# Altium schematic sheet FilterBoard.Schematic.SchDoc
size B
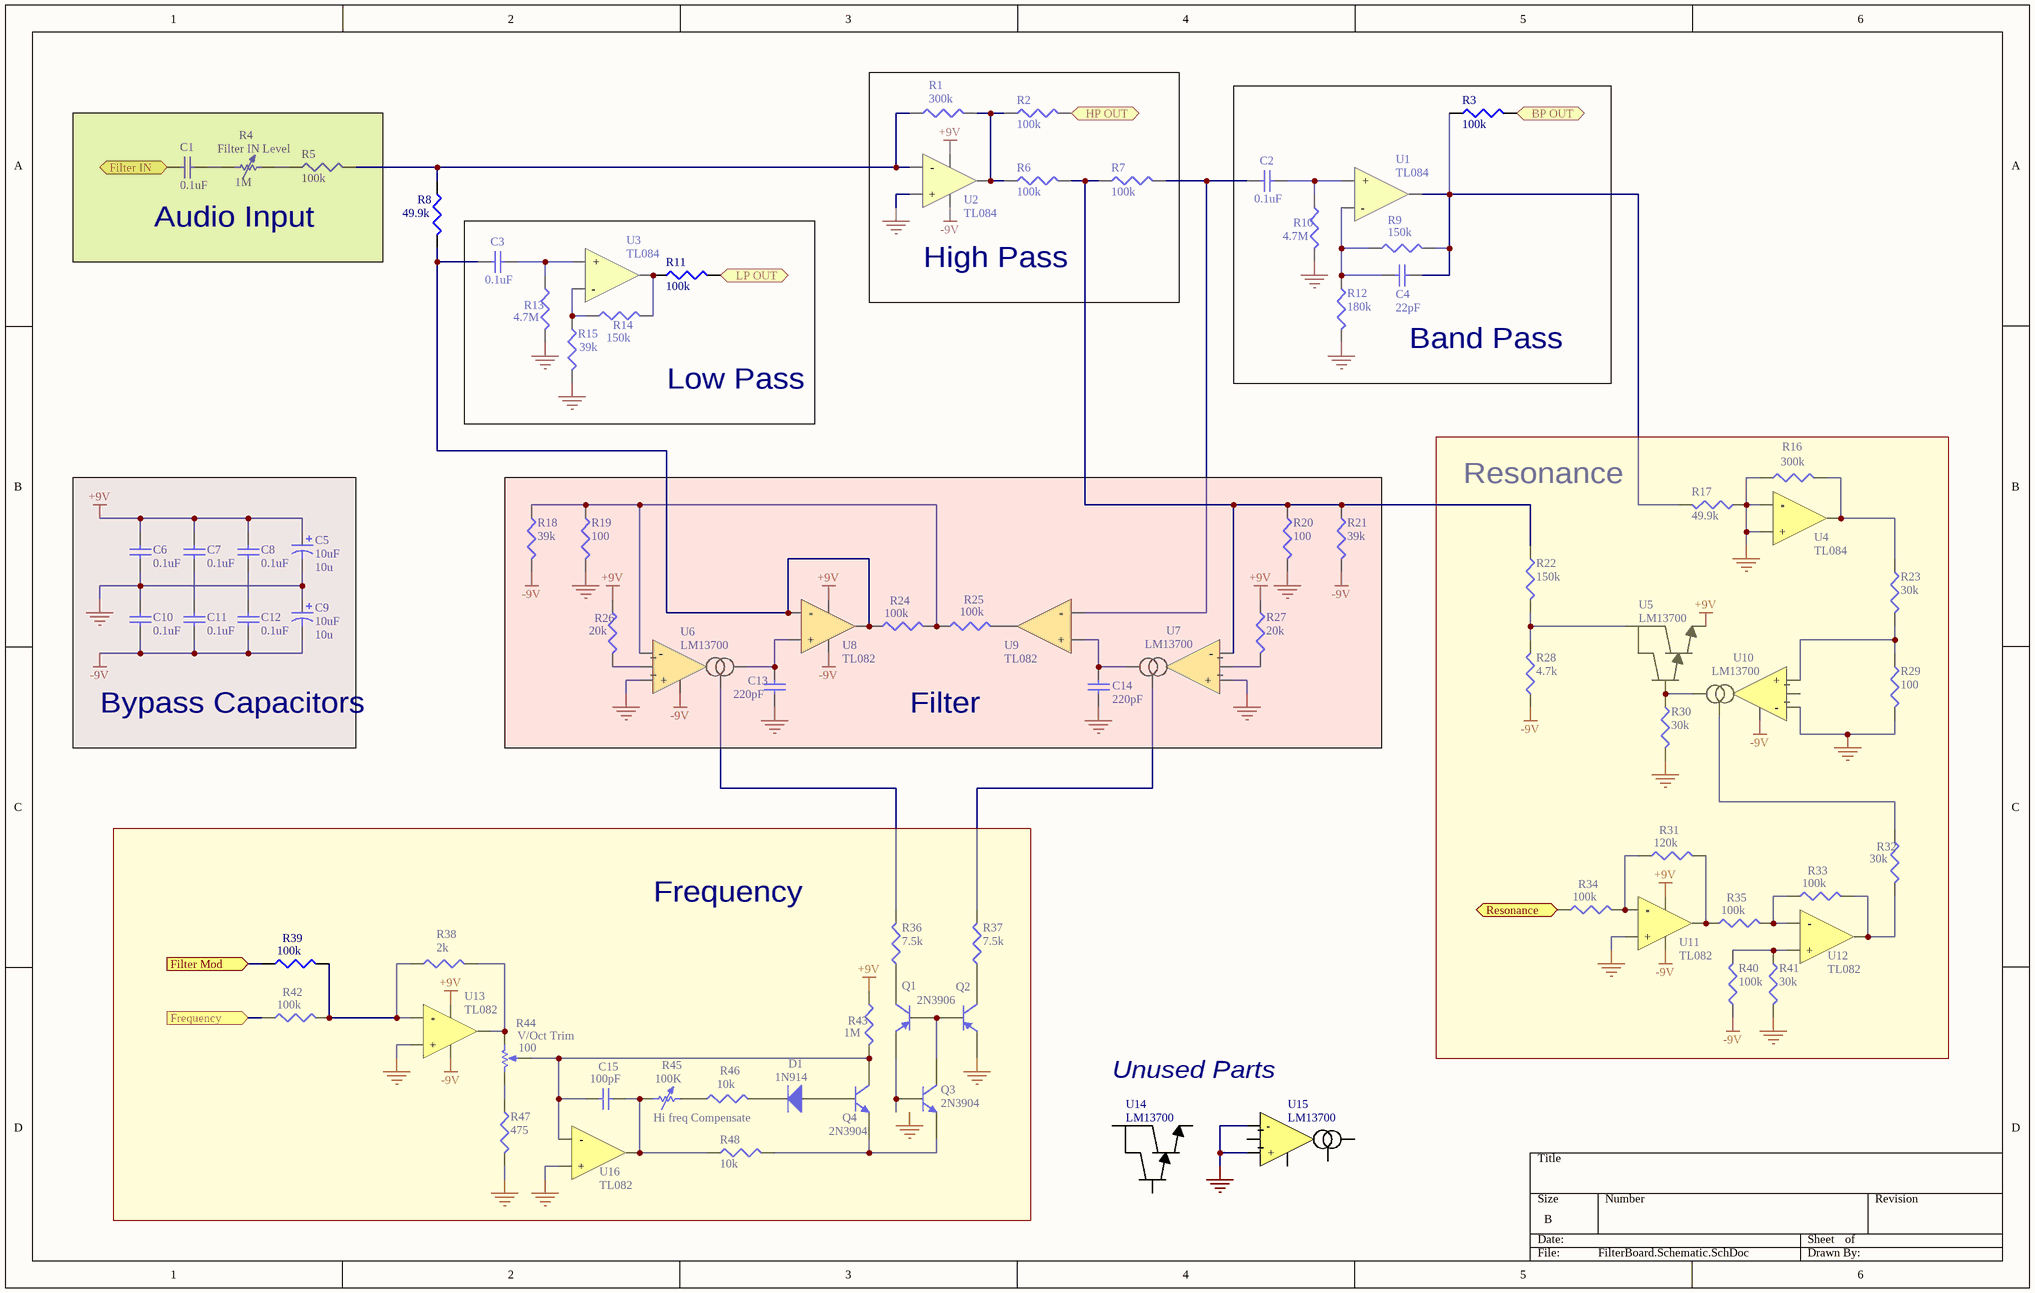
[diagram p0: FilterBoard.Schematic.SchDoc]

## Parts
C1  0.1uF  [C1206]
C2  0.1uF  [C1206]
C3  0.1uF  [C1206]
C4  22pF  [C1206]
C5  10uF  value 10u  [RB7.6-15]
C6  0.1uF  [C1206]
C7  0.1uF  [C1206]
C8  0.1uF  [C1206]
C9  10uF  value 10u  [RB7.6-15]
C10  0.1uF  [C1206]
C11  0.1uF  [C1206]
C12  0.1uF  [C1206]
C13  220pF  [C1206]
C14  220pF  [C1206]
C15  100pF  [C1206]
D1  1N914  [DO-41]
Q1  2N3906  [TO-92A]
Q2  2N3906  [TO-92A]  (value not drawn)
Q3  2N3904  [TO-92A]
Q4  2N3904  [TO-92A]
R1  300k  [J1-0603]
R2  100k  [J1-0603]
R3  100k  [J1-0603]
R4  Filter IN Level  value 1M  [AXIAL-0.7]
R5  100k  [J1-0603]
R6  100k  [J1-0603]
R7  100k  [J1-0603]
R8  49.9k  [J1-0603]
R9  150k  [J1-0603]
R10  4.7M  [J1-0603]
R11  100k  [J1-0603]
R12  180k  [J1-0603]
R13  4.7M  [J1-0603]
R14  150k  [J1-0603]
R15  39k  [J1-0603]
R16  300k  [J1-0603]
R17  49.9k  [J1-0603]
R18  39k  [J1-0603]
R19  100  [J1-0603]
R20  100  [J1-0603]
R21  39k  [J1-0603]
R22  150k  [J1-0603]
R23  30k  [J1-0603]
R24  100k  [J1-0603]
R25  100k  [J1-0603]
R26  20k  [J1-0603]
R27  20k  [J1-0603]
R28  4.7k  [J1-0603]
R29  100  [J1-0603]
R30  30k  [J1-0603]
R31  120k  [J1-0603]
R32  30k  [J1-0603]
R33  100k  [J1-0603]
R34  100k  [J1-0603]
R35  100k  [J1-0603]
R36  7.5k  [J1-0603]
R37  7.5k  [J1-0603]
R38  2k  [J1-0603]
R39  100k  [J1-0603]
R40  100k  [J1-0603]
R41  30k  [J1-0603]
R42  100k  [J1-0603]
R43  1M  [J1-0603]
R44  V/Oct Trim  value 100  [VR5]
R45  Hi freq Compensate  value 100K  [AXIAL-0.7]
R46  10k  [J1-0603]
R47  475  [J1-0603]
R48  10k  [J1-0603]
U1  TL084
U2  TL084
U3  TL084
U4  TL084
U5  LM13700
U6  LM13700
U7  LM13700
U8  TL082
U9  TL082
U10  LM13700
U11  TL082
U12  TL082
U13  TL082
U14  LM13700
U15  LM13700
U16  TL082

## Blocks framed on the sheet
Audio Input: C1 R4 R5
High Pass: R1 R2 R6 R7 U2
Band Pass: C2 C4 R3 R9 R10 R12 U1
Low Pass: C3 R11 R13-R15 U3
Resonance: R16 R17 R22 R23 R28-R35 R40 R41 U4 U5 U10-U12
Bypass Capacitors: C5-C12
Filter: C13 C14 R18-R21 R24-R27 U6-U9
Frequency: C15 D1 Q1-Q4 R36-R39 R42-R48 U13 U16

## Ports
BP OUT (out), Filter IN (in), Filter Mod (in), Frequency (in), HP OUT (out), LP OUT (out), Resonance (in)

## Nets
+9V: C5.1 C6.2 C7.2 C8.2 R26.1 R27.1 R43.1 U2.4(VCC+) U5.8(BOUT) U8.8(VCC+) U11.8(VCC+) U13.8(VCC+)
-9V: C9.2 C10.1 C11.1 C12.1 R18.2 R21.2 R28.1 R40.1 U2.11(VCC-) U6.6(VCC-) U8.4(VCC-) U10.6(VCC-) U11.4(VCC-) U13.4(VCC-)
GND: C5.2 C6.1 C9.1 C10.2 C13.1 C14.1 Q2.1(E) R10.2 R12.2 R13.2 R15.2 R16.1 R17.1 R19.2 R20.2 R29.2 R30.2 R41.2 R47.2 U2.3(+) U4.12(-) U4.13(+) U6.3(+) U7.3(+) U10.3(-) U11.3(+) U13.3(+) U15.3(+) U15.4(-) U16.5(+)
BP OUT: R3.2 ; port BP OUT
Filter IN: C1.1 ; port Filter IN
Filter Mod: R39.1 ; port Filter Mod
Frequency: R42.1 ; port Frequency
HP OUT: R2.2 ; port HP OUT
LP OUT: R11.2 ; port LP OUT
Resonance: R34.1 ; port Resonance
NetC1_2: C1.2 R4.1
NetC2_1: C2.1 R7.2 U9.6(-)
NetC2_2: C2.2 R10.1 U1.5(+)
NetC3_1: C3.1 R8.2 R24.1 U8.1(OUT) U8.2(-)
NetC3_2: C3.2 R13.1 U3.5(+)
NetC4_1: C4.1 R9.1 R12.1 U1.3(-)
NetC4_2: C4.2 R3.1 R9.2 R17.2 U1.7(OUT)
NetC7_1: C7.1 C11.2
NetC8_1: C8.1 C12.2
NetC13_2: C13.2 U6.5(OUT) U8.3(+)
NetC14_2: C14.2 U7.5(OUT) U9.5(+)
NetC15_1: C15.1 Q4.3(C) R43.2 R44.3(TAP) U16.6(-)
NetC15_2: C15.2 R45.1 R48.1 U16.7(OUT)
NetD1_1: D1.1(A) Q4.2(B)
NetD1_2: D1.2(K) R46.2
NetQ1_1: Q1.1(E) Q3.2(B)
NetQ1_2: Q1.2(B) Q2.2(B) Q3.3(C)
NetQ1_3: Q1.3(C) R36.1
NetQ2_3: Q2.3(C) R37.1
NetQ3_1: Q3.1(E) Q4.1(E) R48.2
NetR1_1: R1.1 R5.2 R8.1 U2.2(-)
NetR1_2: R1.2 R2.1 R6.1 U2.1(OUT)
NetR4_2: R4.2 R5.1
NetR6_2: R6.2 R7.1 R20.1 R21.1 R22.1 U7.4(-)
NetR11_1: R11.1 R14.2 U3.7(OUT)
NetR14_1: R14.1 R15.1 U3.3(-)
NetR16_2: R16.2 R23.1 U4.14(OUT)
NetR18_1: R18.1 R19.1 R24.2 R25.1 U6.4(-)
NetR22_2: R22.2 R28.2 U5.11(V+)
NetR23_2: R23.2 R29.1 U10.4(+)
NetR25_2: R25.2 U9.7(OUT)
NetR26_2: R26.2 U6.2
NetR27_2: R27.2 U7.2
NetR30_1: R30.1 U5.7(BIN) U10.5(OUT)
NetR31_1: R31.1 R34.2 U11.2(-)
NetR31_2: R31.2 R35.1 U11.1(OUT)
NetR32_1: R32.1 U10.1(BIAS)
NetR32_2: R32.2 R33.2 U12.7(OUT)
NetR33_1: R33.1 R35.2 U12.6(-)
NetR36_2: R36.2 U6.1(BIAS)
NetR37_2: R37.2 U7.1(BIAS)
NetR38_1: R38.1 R39.2 R42.2 U13.2(-)
NetR38_2: R38.2 R44.1(TOP) U13.1(OUT)
NetR40_2: R40.2 R41.1 U12.5(+)
NetR44_2: R44.2(BOT) R47.1
NetR45_2: R45.2 R46.1

Not connected (* = marked no-connect by the designer): U1 6(VCC+) 11(VCC-); U3 6(VCC+) 11(VCC-); U4 1(VCC+) 11(VCC-); U7 6(VCC-); U9 4(VCC-) 8(VCC+); U10 2; U12 4(VCC-) 8(VCC+); U14 7(BIN) 8(BOUT) 11(V+); U15 1(BIAS) 2 5(OUT) 6(VCC-); U16 4(VCC-) 8(VCC+)

## Notes on the sheet
- Unused Parts
- Labels drawn without touching a wire or pin: GND

## Library data of the parts
C1-C3 C6-C8 C10-C12 = Cap Semi: Capacitor (Semiconductor SIM Model); Value: 0.1u; Published: 8-Jun-2000; LatestRevisionDate: 29-May-2009; LatestRevisionNote: IPC-7351 Footprint Added.; PackageReference: C1206; Publisher: Altium Limited; PackageDescription: Chip Capacitor
C4 = Cap Semi: Capacitor (Semiconductor SIM Model); Value: 22p; Published: 8-Jun-2000; LatestRevisionDate: 29-May-2009; LatestRevisionNote: IPC-7351 Footprint Added.; PackageReference: C1206; Publisher: Altium Limited; PackageDescription: Chip Capacitor
C5 C9 = Cap Pol1: Polarized Capacitor (Radial); Published: 8-Jun-2000; LatestRevisionDate: 17-Jul-2002; LatestRevisionNote: Re-released for DXP Platform.; PackageReference: RB7.6-15; Publisher: Altium Limited; PackageDescription: Polarized Capacitor (Radial); 2 Leads
C13 C14 = Cap Semi: Capacitor (Semiconductor SIM Model); Value: 220p; Published: 8-Jun-2000; LatestRevisionDate: 29-May-2009; LatestRevisionNote: IPC-7351 Footprint Added.; PackageReference: C1206; Publisher: Altium Limited; PackageDescription: Chip Capacitor
C15 = Cap Semi: Capacitor (Semiconductor SIM Model); Value: 100p; Published: 8-Jun-2000; LatestRevisionDate: 29-May-2009; LatestRevisionNote: IPC-7351 Footprint Added.; PackageReference: C1206; Publisher: Altium Limited; PackageDescription: Chip Capacitor
D1 = Diode 1N4001: 1 Amp General Purpose Rectifier; Published: 8-Jun-2000; LatestRevisionDate: 17-Jul-2002; LatestRevisionNote: Re-released for DXP Platform.; DatasheetVersion: 1998; PackageVersion: Aug-1999; PackageReference: DO-41; Publisher: Altium Limited; PackageDescription: Diode, Axial; Body 5.2 x 2.7 mm (LxDia. max), Lead Dia. 0.86 mm (max); Code_JEDEC: DO-204-AL; ComponentLink1Description: Manufacturer Link; ComponentLink1URL: http://www.fairchildsemi.com/; ComponentLink2Description: Datasheet; ComponentLink2URL: http://www.fairchildsemi.com/ds/1N%2F1N4001.pdf
Q1 Q2 = 2N3906: PNP General Purpose Amplifier; Published: 8-Jun-2000; LatestRevisionDate: 15-Jan-2003; LatestRevisionNote: PCB Footprint 'BCY-W3/D4.7' replaced; DatasheetVersion: 1997; PackageVersion: Sep-1998; PackageReference: TO-92A; Publisher: Altium Limited; PackageDescription: TO, Flat Index; 3 In-Line, Axial Leads; Body Dia. 4.5mm; Leads 0.51 x 0.48 mm (max); ComponentLink1Description: Manufacturer Link; ComponentLink1URL: http://www.fairchildsemi.com/; ComponentLink2Description: Datasheet; ComponentLink2URL: http://www.fairchildsemi.com/ds/2N%2F2N3906.pdf
Q3 Q4 = 2N3904: NPN General Purpose Amplifier; Published: 8-Jun-2000; LatestRevisionDate: 15-Jan-2003; LatestRevisionNote: PCB Footprint 'BCY-W3/D4.7' replaced; DatasheetVersion: 1997; PackageVersion: Sep-1998; PackageReference: TO-92A; Publisher: Altium Limited; PackageDescription: TO, Flat Index; 3 In-Line, Axial Leads; Body Dia. 4.5mm; Leads 0.51 x 0.48 mm (max); ComponentLink1Description: Manufacturer Link; ComponentLink1URL: http://www.fairchildsemi.com/; ComponentLink2Description: Datasheet; ComponentLink2URL: http://www.fairchildsemi.com/ds/2N%2F2N3904.pdf
R1-R3 R5-R43 R46-R48 = Res3: Resistor; Published: 8-Jun-2000; LatestRevisionDate: 29-May-2009; LatestRevisionNote: IPC-7351 Footprint Added.; PackageReference: J1-0603; Publisher: Altium Limited; PackageDescription: Chip Resistor
  R1 R16: Value: 300K
  R2 R3 R5-R7 R11 R24 R25 R33-R35 R39 R40 R42: Value: 100K
  R8 R17: Value: 49.9K
  R9 R14 R22: Value: 150K
  R10 R13: Value: 4.7M
  R12: Value: 180K
  R15 R18 R21: Value: 39K
  R19 R20 R29: Value: 100
  R23 R30 R32 R41: Value: 30K
  R26 R27: Value: 20K
  R28: Value: 4.7K
  R31: Value: 120K
  R36 R37: Value: 7.5K
  R38: Value: 2K
  R43: Value: 1M
  R46 R48: Value: 10K
  R47: Value: 475
R4 R45 = Res Adj1: Variable Resistor; Set Position: 0.5; Published: 8-Jun-2000; LatestRevisionDate: 17-Jul-2002; LatestRevisionNote: Re-released for DXP Platform.; PackageReference: AXIAL-0.7; Publisher: Altium Limited; PackageDescription: Axial Device, Thru-Hole; 2 Leads; 0.7 in Pin Spacing
R44 = RPot: Potentiometer; Sim Note: Enter the Resistance value and the set point into parameter fields.; Set Position: 0.5; Published: 8-Jun-2000; LatestRevisionDate: 17-Jul-2002; LatestRevisionNote: Re-released for DXP Platform.; PackageReference: VR5; Publisher: Altium Limited; PackageDescription: Variable Resistor, Thru-Hole; 3 Leads
U5 U14 = LM13700_1